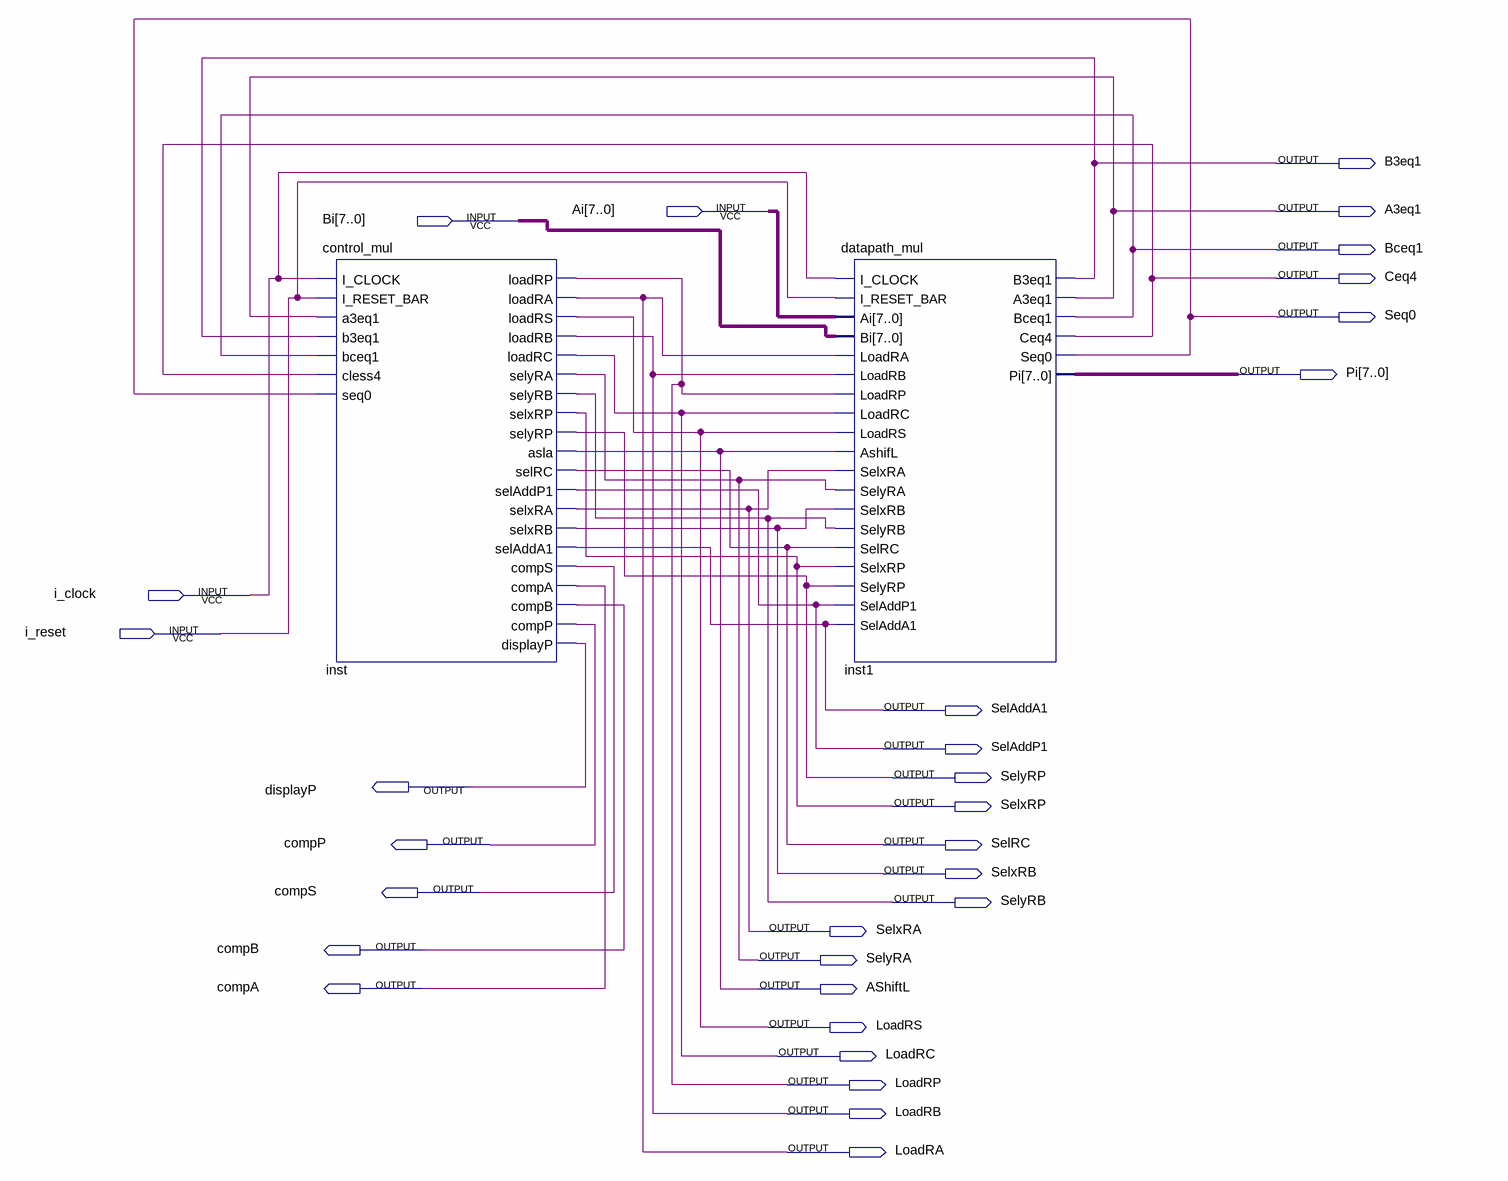
[diagram p0: schematic sheet]
// Quartus schematic mul_top.bdf as structural Verilog: 2 symbols, 30 pins
module mul_top (
  input  [7:0] Ai,
  input  [7:0] Bi,
  input  i_clock,
  input  i_reset,
  output B3eq1,
  output A3eq1,
  output Bceq1,
  output Ceq4,
  output Seq0,
  output [7:0] Pi,
  output SelAddA1,
  output SelAddP1,
  output SelyRP,
  output displayP,
  output SelxRP,
  output compP,
  output SelRC,
  output SelxRB,
  output compS,
  output SelyRB,
  output SelxRA,
  output compB,
  output SelyRA,
  output compA,
  output AShiftL,
  output LoadRS,
  output LoadRC,
  output LoadRP,
  output LoadRB,
  output LoadRA
);

  control_mul inst (
    .I_CLOCK(i_clock), .I_RESET_BAR(i_reset), .a3eq1(A3eq1), .b3eq1(B3eq1), .bceq1(Bceq1), .cless4(Ceq4),
    .seq0(Seq0), .loadRP(LoadRP), .loadRA(LoadRA), .loadRS(LoadRS), .loadRB(LoadRB), .loadRC(LoadRC),
    .selyRA(SelyRA), .selyRB(SelyRB), .selxRP(SelxRP), .selyRP(SelyRP), .asla(AShiftL), .selRC(SelRC),
    .selAddP1(SelAddP1), .selxRA(SelxRA), .selxRB(SelxRB), .selAddA1(SelAddA1), .compS(compS), .compA(compA),
    .compB(compB), .compP(compP), .displayP(displayP));
  datapath_mul inst1 (
    .I_CLOCK(i_clock), .I_RESET_BAR(i_reset), .Ai(Ai), .Bi(Bi), .LoadRA(LoadRA), .LoadRB(LoadRB),
    .LoadRP(LoadRP), .LoadRC(LoadRC), .LoadRS(LoadRS), .AshifL(AShiftL), .SelxRA(SelxRA), .SelyRA(SelyRA),
    .SelxRB(SelxRB), .SelyRB(SelyRB), .SelRC(SelRC), .SelxRP(SelxRP), .SelyRP(SelyRP), .SelAddP1(SelAddP1),
    .SelAddA1(SelAddA1), .B3eq1(B3eq1), .A3eq1(A3eq1), .Bceq1(Bceq1), .Ceq4(Ceq4), .Seq0(Seq0), .Pi(Pi));
endmodule
